# EAGLE design 123_relay_106 (EAGLE 9.6.0)
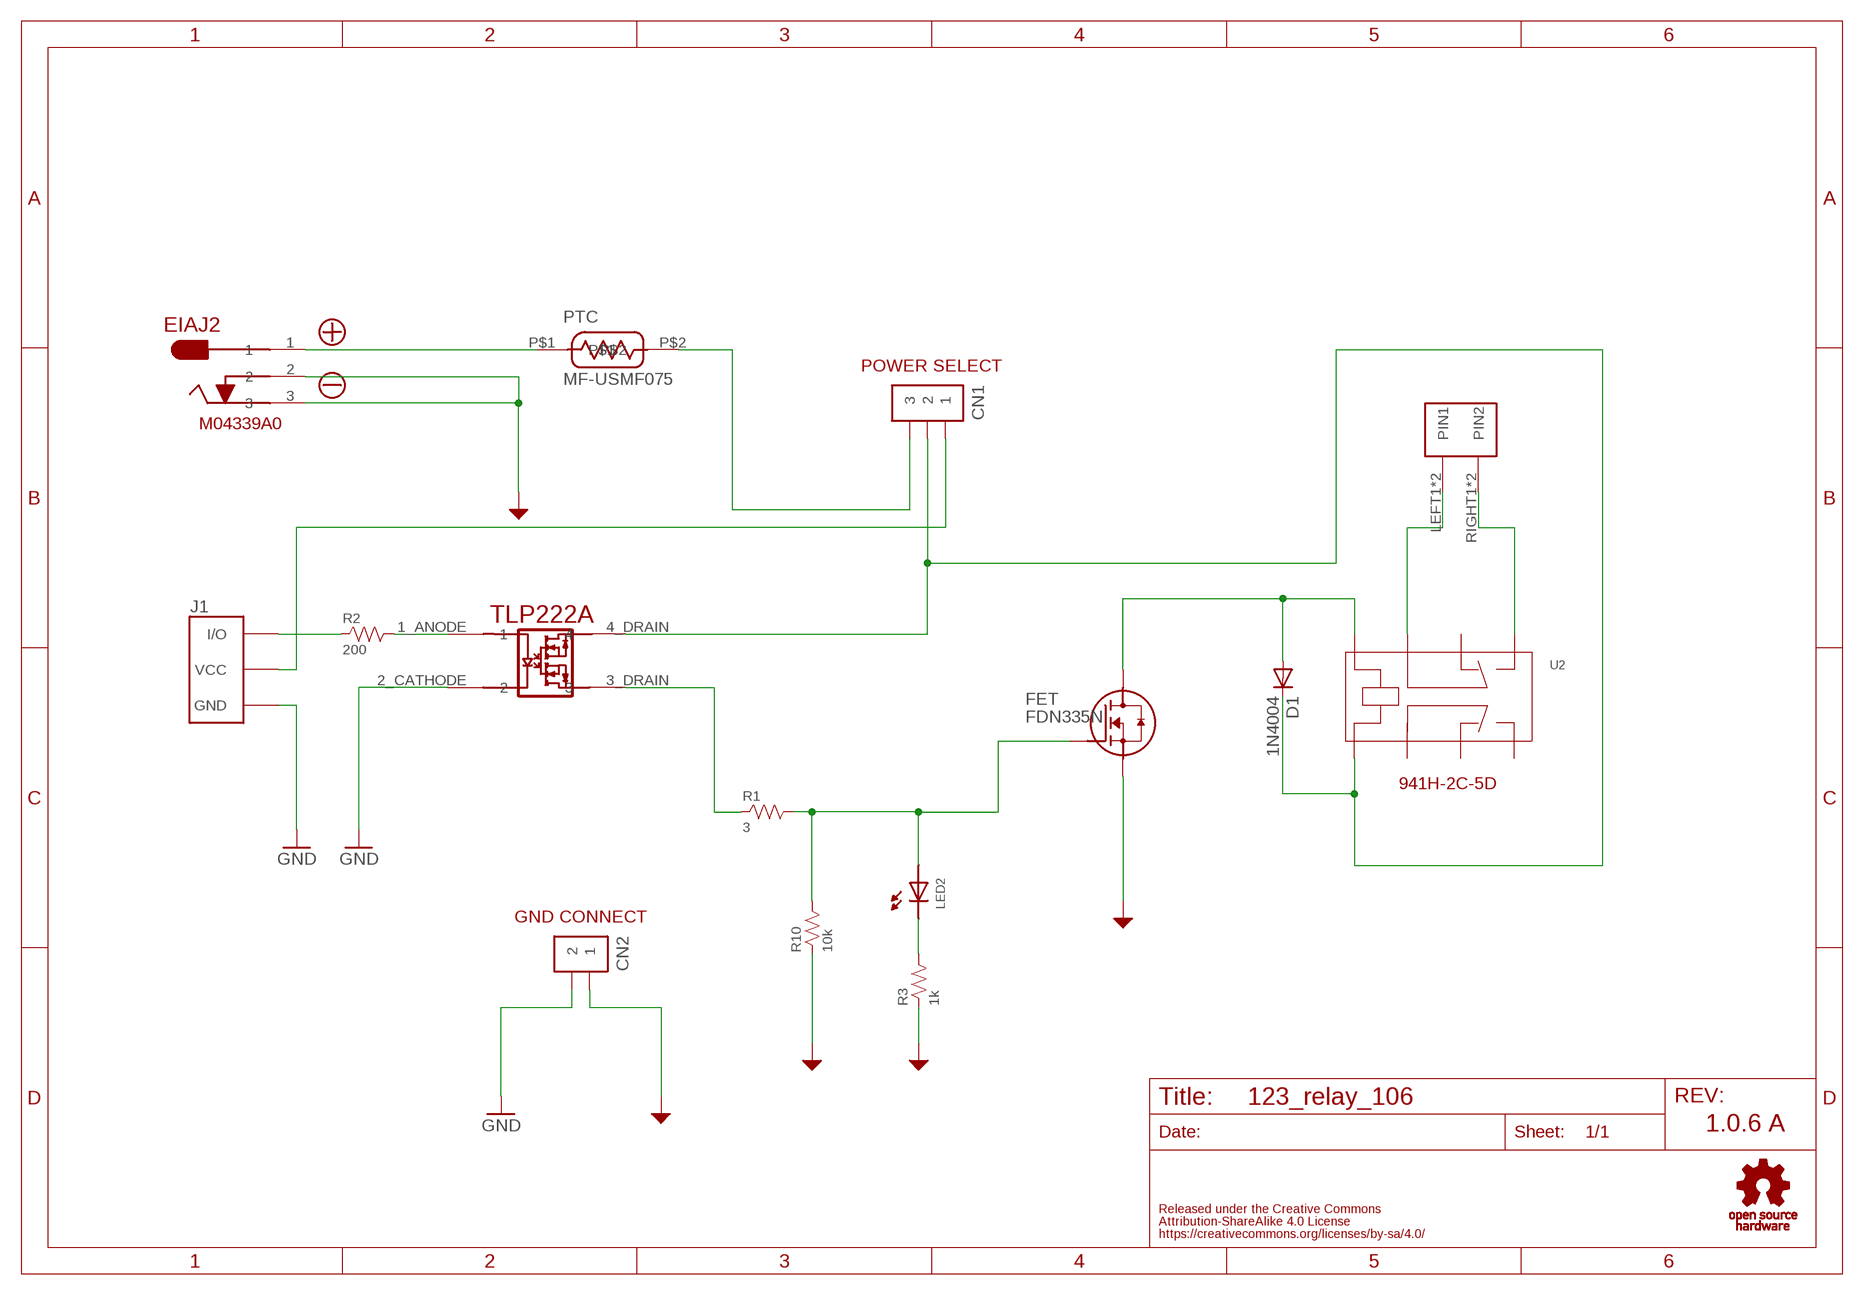
[diagram p0: schematic, sheet 1]

## Parts
CN1  PIN_HEADER_1X3  [PIN_1X3]
CN2  PIN_HEADER_1X2  [PIN_1X2]
D1  1N4004  [DO41-10]
FET  FDN335N  [FDN335]
J1  FABO_BRICK_3PIN-LONG  [FABO_BRICK_3PIN_LONG]
LED2  LED-0603  [0603]
PTC  MF-USMF075  [MF-USMF075]
R1  3  RESISTOR-0603-NARROW  [0603-NARROW]
R2  200  RESISTOR-0603-NARROW  [0603-NARROW]
R3  1k  RESISTOR-0603-NARROW  [0603-NARROW]
R10  10k  RESISTOR-0603-NARROW  [0603-NARROW]
RELAY2  ML-1400-S1  [ML-1400-S1]
U2  941-RELAY  [941_RELAY]
U$2  LOGO_OSHW-M_BOTTOM  [LOGO_OSHW_M_BOTTOM]
U$7  M04339A0  [M04339A0]
U$9  TLP222A  [TLP222A]

## Nets
GND: CN2.2 J1.GND U$9.2_CATHODE
GND_SECONDARY: CN2.1 FET.2:S(S) R3.1 R10.1 U$7.2 U$7.3 ; supply symbol labelled GND_SEC
N$1: J1.I/O R2.1
N$2: RELAY2.LEFT1(PIN1) RELAY2.LEFT2(PIN1) U2.13
N$3: RELAY2.RIGHT1(PIN2) RELAY2.RIGHT2(PIN2) U2.9
N$5: R2.2 U$9.1_ANODE
N$7: CN1.1 J1.VCC
N$8: LED2.CATHODE R3.2
N$9: CN1.3 PTC.P$2
N$10: CN1.2 D1.C U2.1 U$9.4_DRAIN
N$11: PTC.P$1 U$7.1
N$13: D1.A FET.3:D(D) U2.16
N$14: R1.1 U$9.3_DRAIN
RELAY02: FET.1:G(G) LED2.ANODE R1.2 R10.2
Unconnected: U2.4 U2.6 U2.8 U2.11

## Notes on the sheet
- POWER SELECT
- 941H-2C-5D
- GND CONNECT
- 1.0.6 A

## Library data of the parts
CN1 = FaBo-PIN:PIN_HEADER_1X3
CN2 = FaBo-PIN:PIN_HEADER_1X2
D1 = diode:1N4004: DIODE general purpose rectifier, 1 A
FET = FaBo-Mosfet:FDN335N
J1 = FaBo-Template:FABO_BRICK_3PIN: FaBo Brick 3pin
LED2 = FaBo-LED:LED
PTC = FaBo_PTC_ResettableFuses:MF-USMF075
R1-R3 R10 = FaBo-Resistors:RESISTOR: RESISTOR
RELAY2 = FaBo-Terminal:ML-1400-S1
U2 = FaBo-Relay:941-RELAY
U$2 = FaBo-etc:LOGO_OSHW
U$7 = FaBo_Connector:M04339A0
U$9 = FaBo_Photocoupler:TLP222A

## Board
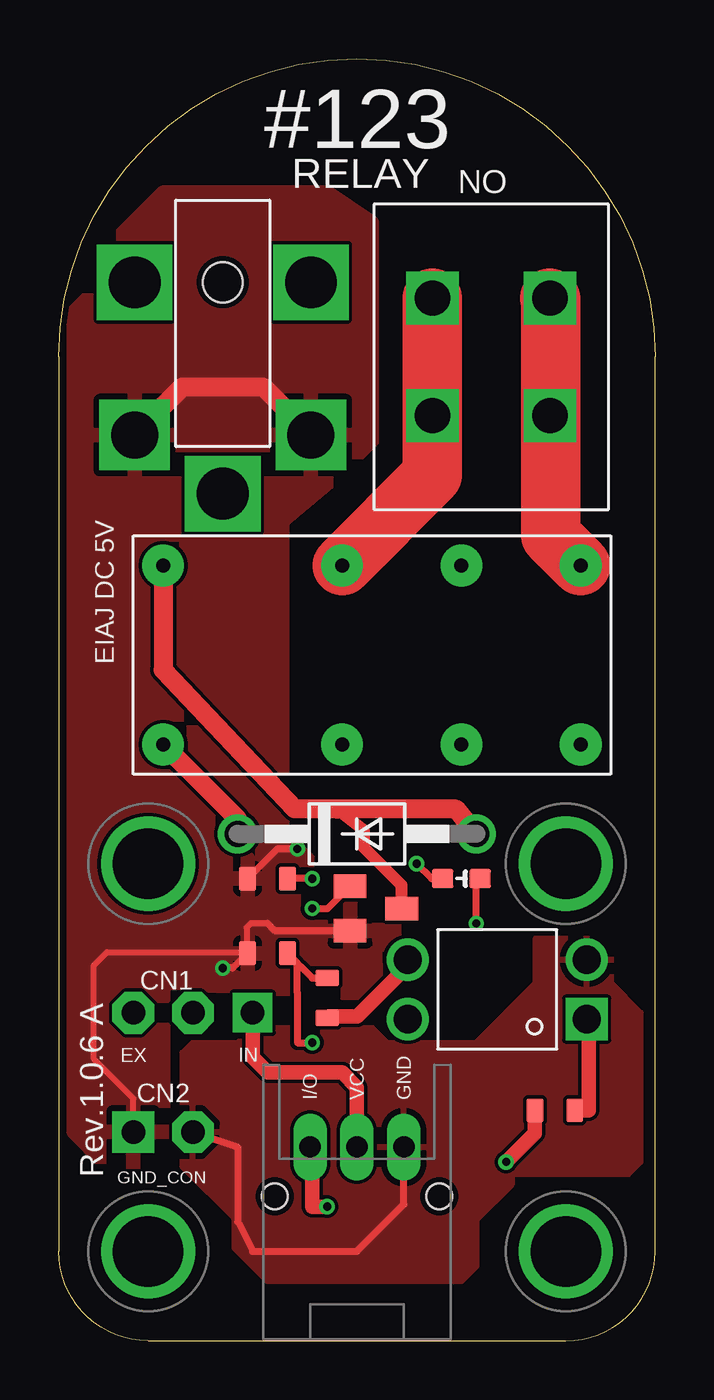
[diagram p1: board, top side]
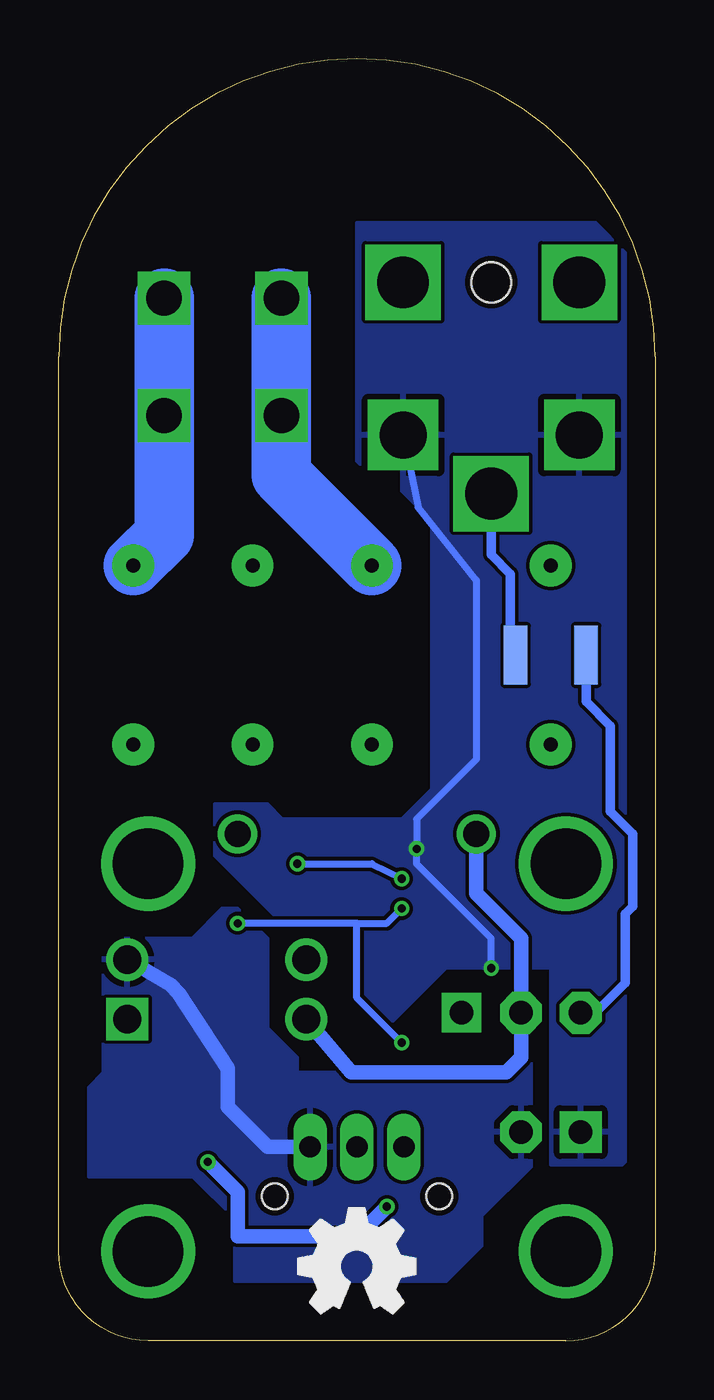
[diagram p2: board, bottom side, seen from below]

Size 25.4 x 54.61 mm. Coordinates in mm from the lower left corner, seen from the top.
Copper layers (1*16): Top 0.035mm / dielectric 1.5mm / Bottom 0.035mm
Design rules "SeeedStudio_2layer_DRU_no_angle_20140221": minimum track width 6mil, minimum drill 12mil, track to track 6mil, track to pad 6mil, pad to pad 6mil, via to via 6mil, smd to smd 0mil, copper to edge 10mil, drill to drill 10mil, minimum pad ring 10mil, minimum via ring 6mil, stop-mask expansion 2mil, vias tented up to drill 100mil, thermal gap 10mil
tRestrict: area 10.2,30.5 to 24.1,47; area 10.2,23.5 to 23.5,27.3
bRestrict: area 10.2,30.5 to 24.1,47; area 10.2,23.5 to 23.5,27.3

### Footprints (pad centres in the part's own frame; a part is rotated, then mirrored left to right if it is on the bottom)
PIN_1X3 = drill 1 pad 1.676 square: 1 -2.54,0 | drill 1 pad 1.778 octagon: 2 0,0; 3 2.54,0
PIN_1X2 = drill 1 pad 1.778 square: 1 -1.27,0 | drill 1 pad 1.778 octagon: 2 1.27,0
DO41-10 = drill 1.118: A 5.08,0; C -5.08,0
FDN335 = smd 1 x 1.4: 1:G -0.95,-2.2; 2:S 0.95,-2.2; 3:D 0,0
FABO_BRICK_3PIN_LONG = drill 0.9 pad 1.422 long: GND 2,-6.985; I/O -2,-6.985; VCC 0,-6.985 | drill 3 pad 3.81: P$1 -8.89,5.08; P$2 8.89,5.08; P$3 -8.89,-11.43; P$4 8.89,-11.43 | hole 1.1: -3.5,-9.085; 3.5,-9.085
0603 = smd 0.9 x 0.8: ANODE -0.8,0; CATHODE 0.8,0
MF-USMF075 = smd 1 x 2.5: P$1 -1.5,0; P$2 1.5,0
0603-NARROW = smd 0.71 x 1: 1 -0.85,0; 2 0.85,0
ML-1400-S1 = drill 1.5 square: LEFT1 -2.5,2.5; LEFT2 -2.5,-2.5; RIGHT1 2.5,2.5; RIGHT2 2.5,-2.5
941_RELAY = drill 0.6 pad 1.778: 1 -10.16,-3.81; 4 -2.54,-3.81; 6 2.54,-3.81; 8 7.62,-3.81; 9 7.62,3.81; 11 2.54,3.81; 13 -2.54,3.81; 16 -10.16,3.81
M04339A0 = drill 2.2 square: 1 0,-9; 4 3.75,0; 5 -3.75,0 | drill 2 square: 2 3.75,-6.5; 3 -3.75,-6.5 | hole 1.7: 0,0
TLP222A = drill 1.2 square: 1_ANODE 0,0 | drill 1.2: 2_CATHODE 0,-2.54; 3_DRAIN 7.62,-2.54; 4_DRAIN 7.62,0

### Placement (x,y rotation side)
CN1  5.71,13.97 180 top
CN2  4.45,8.89 0 top
D1  12.7,21.59 0 top
FET  14.61,18.41 270 top
J1  12.7,15.24 0 top
LED2  17.14,19.68 180 top
PTC  4.45,29.21 0 bottom
R1  11.43,14.61 90 top
R2  21.12,9.82 0 top
R3  8.89,19.68 0 top
R10  8.89,16.51 0 top
RELAY2  18.41,41.91 0 top
U2  14.61,29.21 0 top
U$2  12.7,3.17 0 top
U$7  6.99,45.09 0 top
U$9  22.48,13.7 180 top

### Tracks (layer width: path | path; a pad name or v marks a point on that pad's centre or on a via)
GND
  Top 0.305: CN2.2 7.62,8.26 7.62,5.08 8.26,3.81 12.7,3.81 14.7,5.81 J1.GND
  Bottom 0.61: U$9.2_CATHODE 20.63,15.16 20.3,14.8 18.19,11.6 18.19,9.96 16.49,8.26 J1.GND
  pour Bottom: 5.28,15.24 8.26,15.24 12.06,11.43 15.24,11.43 15.24,12.06 16.51,13.34 16.51,17.14 17.78,18.41 18.45,18.41 19.72,17.14 22.86,17.14 23.5,16.51 23.5,11.43 24.13,10.79 24.13,6.99 19.68,6.99 17.91,5.21 17.91,2.54 8.89,2.54 7.38,4.04 7.38,5.32 5.28,7.42
  pour Top: 5.28,7.42 5.28,12.27 5.71,12.7 7.62,12.7 8.26,13.34 13.34,13.34 13.97,12.7 17.78,12.7 20.32,15.24 20.32,17.14 23.5,17.14 23.5,15.24 24.77,13.97 24.77,7.62 24.23,7.08 19.29,7.08 19.29,6.65 17.78,5.14 17.78,3.17 17.14,2.54 8.89,2.54 7.49,3.94 7.49,5.21
GND_SECONDARY  (via drill 0.35)
  Top 0.254: 8.89,17.78 8.18,17.78 8,17.6 8,16.55 | 8,16.55 R10.1 | CN2.1 3.17,10.32 1.5,12 1.5,16 2.05,16.55 8,16.55
  Top 0.305: R10.1 7.41,15.88 v6.99,15.88 | v10.16,20.95 9.31,20.95 R3.1 | FET.2:S 9.21,17.46 8.89,17.78
  Top 0.813: U$7.3 5.29,40.64 8.68,40.64 U$7.2
  Bottom 0.305: v6.99,15.88 6.99,17.14 10.16,20.32 v10.16,20.95 10.16,22.23 7.62,24.77 7.62,32.38 10.1,35.5 U$7.2
  pour Top: 0.64,43.81 1.91,45.09 1.91,46.35 4.45,48.9 11.43,48.9 13.34,47.62 13.34,38.1 9.53,34.92 9.53,21.59 12.7,18.41 15.88,17.78 15.88,14.61 4.45,15.24 4.45,7.62 1.91,7.62 0.64,8.89
  pour Bottom: 2.54,47.62 12.7,47.62 12.7,37.47 12.06,36.83 10.79,36.83 10.79,36.2 9.53,34.92 9.53,23.5 10.79,22.23 15.88,22.23 16.51,22.86 18.75,22.86 18.75,20.66 15.88,17.78 15.88,13.97 14.61,12.7 14.61,12.06 12.7,12.06 8.89,15.88 4.45,15.88 4.45,7.49 1.41,7.49 1.27,7.62 1.27,46.35
N$1  (via drill 0.35)
  Top 0.61: J1.I/O 10.79,8.16 10.79,5.71 v11.43,5.71 | v19.05,7.62 20.27,8.85 R2.1
  Bottom 0.61: v11.43,5.71 12.7,4.45 17.78,4.45 17.78,6.35 v19.05,7.62
N$2
  Top 2.54: U2.13 15.91,36.87 RELAY2.LEFT1
  Bottom 2.54: RELAY2.LEFT1 RELAY2.LEFT2 15.91,36.87 U2.13
N$3
  Top 2.54: U2.9 20.95,34.29 20.95,44.37 RELAY2.RIGHT1
  Bottom 2.54: RELAY2.RIGHT1 RELAY2.RIGHT2 20.91,34.33 U2.9
N$5
  Top 0.61: R2.2 22.58,9.82 22.58,13.56 U$9.1_ANODE
N$7
  Top 0.61: J1.VCC 12.7,10.79 12.06,11.43 8.89,11.43 8.26,12.06 CN1.1
N$8  (via drill 0.35)
  Top 0.305: LED2.CATHODE 15.88,19.68 v15.24,20.32 | v10.79,19.68 R3.2
  Bottom 0.305: v15.24,20.32 12.06,20.32 v10.79,19.68
N$9
  Bottom 0.406: PTC.P$2 2.94,27.23 1.92,26.2 1.92,22.55 0.96,21.6 0.96,18.49 1.27,18.19 1.27,15.26 2.55,13.97 CN1.3
N$10
  Top 0.813: D1.C 7.62,22.23 U2.1
  Bottom 0.61: D1.C 7.62,19.05 5.71,17.14 CN1.2 5.71,12.06 6.35,11.43 12.94,11.43 U$9.4_DRAIN
N$11
  Bottom 0.406: U$7.1 6.99,33.48 6.17,32.66 6.17,29.43 PTC.P$1
N$13
  Top 0.508: FET.3:D 14.61,19.4 13,21 13,21.74 11.84,22.65
  Top 0.813: U2.16 4.45,28.57 10.05,22.66 11.84,22.65 16.92,22.65 D1.A
N$14
  Top 0.61: R1.1 11.49,13.82 12.71,13.82 14.73,15.84 U$9.3_DRAIN
RELAY02  (via drill 0.35)
  Top 0.305: v10.79,12.7 10.16,12.7 10.16,14.61 10.16,14.82 10.16,16.09 R10.2 10.79,15.46 R1.2 | v17.78,17.78 17.78,19.52 LED2.ANODE | v10.79,18.41 11.46,18.41 FET.1:G
  Bottom 0.305: 12.7,17.78 12.7,14.61 v10.79,12.7 | 12.7,17.78 v17.78,17.78 | 12.7,17.78 11.43,17.78 v10.79,18.41

### Text on the board
tPlace: #123 | RELAY | NO | EIAJ DC 5V | EX | IN | Rev.1.0.6 A | GND_CON